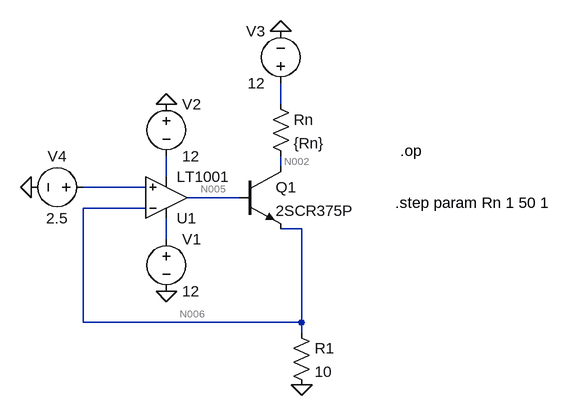
[diagram p0: schematic task3.asc]
task3.asc, the LTspice schematic file:
Version 4.1
SHEET 1 880 680
WIRE 432 32 432 0
WIRE 432 128 432 112
WIRE 256 144 256 112
WIRE 224 160 128 160
WIRE 368 176 288 176
WIRE 224 192 128 192
WIRE 464 224 432 224
WIRE 256 240 256 208
WIRE 128 368 128 192
WIRE 464 368 464 224
WIRE 464 368 128 368
WIRE 464 384 464 368
FLAG 256 32 0
FLAG 256 320 0
FLAG 464 464 0
FLAG 432 -80 0
FLAG 48 160 0
SYMBOL voltage 256 224 R0
SYMATTR InstName V1
SYMATTR Value 12
SYMBOL voltage 256 16 R0
SYMATTR InstName V2
SYMATTR Value 12
SYMBOL npn 368 128 R0
SYMATTR InstName Q1
SYMATTR Value 2SCR375P
SYMBOL res 448 368 R0
SYMATTR InstName R1
SYMATTR Value 10
SYMBOL res 416 16 R0
SYMATTR InstName Rn
SYMATTR Value {Rn}
SYMBOL voltage 432 16 R180
WINDOW 0 24 96 Left 2
WINDOW 3 24 16 Left 2
SYMATTR InstName V3
SYMATTR Value 12
SYMBOL OpAmps\\LT1001 256 240 M180
SYMATTR InstName U1
SYMBOL voltage 144 160 R90
WINDOW 0 -32 56 VBottom 2
WINDOW 3 32 56 VTop 2
SYMATTR InstName V4
SYMATTR Value 2.5
TEXT 616 104 Left 2 !.op
TEXT 608 184 Left 2 !.step param Rn 1 50 1

The netlist it stands for:
* task3.asc
V1 N007 0 12
V2 0 N003 12
Q1 N002 N005 N006 0 2SCR375P
R1 N006 0 10
Rn N001 N002 {Rn}
V3 N001 0 12
X§U1 N004 N006 N007 N003 N005 LT1001  ; pins In+ In- V+ V- OUT
V4 N004 0 2.5
.model NPN NPN
.model PNP PNP
.lib standard.bjt
.op
.step param Rn 1 50 1
.lib LTC.lib
.backanno
.end

* Results of the author's LTspice run, read from the files saved beside the schematic
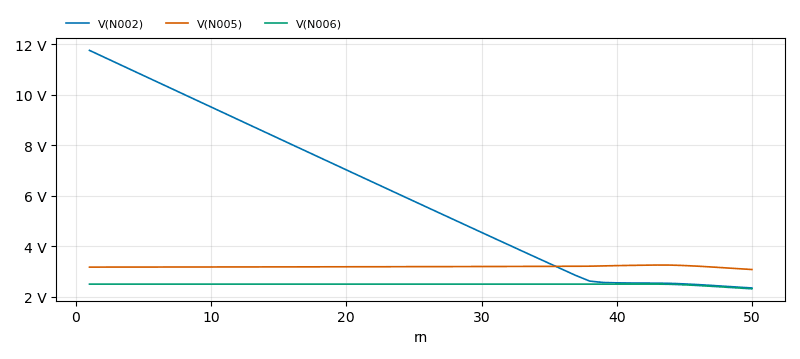
[diagram p1: Operating Point of task3.asc, plotted from the saved traces]
* Operating Point, 1 run:
*   V(N002): 11.75 V at rn=1 , 2.348 V at rn=50 , min 2.348 V, max 11.75 V
*   V(N005): 3.173 V at rn=1 , 3.078 V at rn=50 , min 3.078 V, max 3.255 V
*   V(N006): 2.5 V at rn=1 , 2.315 V at rn=50 , min 2.315 V, max 2.5 V